# Altium project FS001_Neopixel-Bar-1x32.PrjPcb
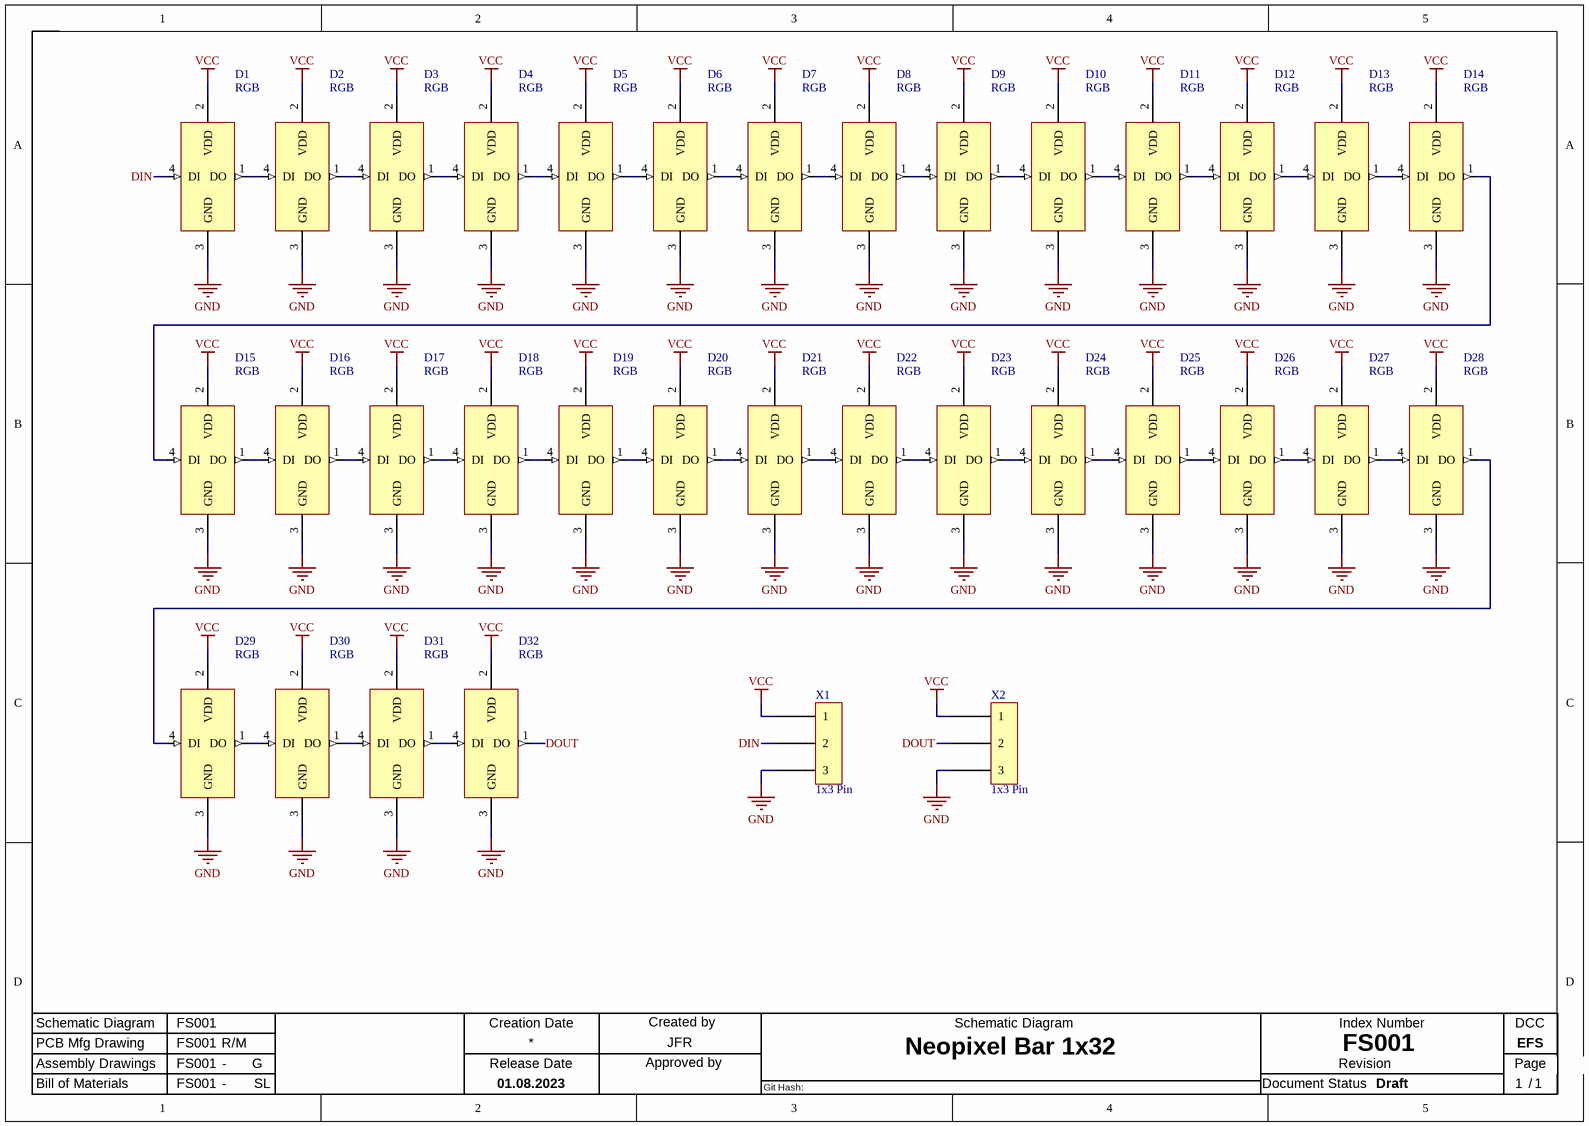
[diagram p0: FS001.SchDoc]
Ausgabedatum: 01.08.2023; Bearbeitende_Person: JFR; Dokumenten_Status: Draft; Leiterplatten_Geraetebezeichnung: Neopixel Bar 1x32; Schaltung_SA_Nummer: FS001
1 sheet, 34 parts. Net scope: global (net labels, ports and power ports of the same name join across sheets).
Board file: FS001.PcbDoc

## Sheet FS001.SchDoc
size 297 x 209 mm; SheetNumber: 1; SheetTotal: 1

### Parts
D1  value RGB  [XINGLIGHT - XL1615RGBC-WS2812B]  (hidden comment: XINGLIGHT - XL-1615RGBC-WS2812B)
D2  value RGB  [XINGLIGHT - XL1615RGBC-WS2812B]  (hidden comment: XINGLIGHT - XL-1615RGBC-WS2812B)
D3  value RGB  [XINGLIGHT - XL1615RGBC-WS2812B]  (hidden comment: XINGLIGHT - XL-1615RGBC-WS2812B)
D4  value RGB  [XINGLIGHT - XL1615RGBC-WS2812B]  (hidden comment: XINGLIGHT - XL-1615RGBC-WS2812B)
D5  value RGB  [XINGLIGHT - XL1615RGBC-WS2812B]  (hidden comment: XINGLIGHT - XL-1615RGBC-WS2812B)
D6  value RGB  [XINGLIGHT - XL1615RGBC-WS2812B]  (hidden comment: XINGLIGHT - XL-1615RGBC-WS2812B)
D7  value RGB  [XINGLIGHT - XL1615RGBC-WS2812B]  (hidden comment: XINGLIGHT - XL-1615RGBC-WS2812B)
D8  value RGB  [XINGLIGHT - XL1615RGBC-WS2812B]  (hidden comment: XINGLIGHT - XL-1615RGBC-WS2812B)
D9  value RGB  [XINGLIGHT - XL1615RGBC-WS2812B]  (hidden comment: XINGLIGHT - XL-1615RGBC-WS2812B)
D10  value RGB  [XINGLIGHT - XL1615RGBC-WS2812B]  (hidden comment: XINGLIGHT - XL-1615RGBC-WS2812B)
D11  value RGB  [XINGLIGHT - XL1615RGBC-WS2812B]  (hidden comment: XINGLIGHT - XL-1615RGBC-WS2812B)
D12  value RGB  [XINGLIGHT - XL1615RGBC-WS2812B]  (hidden comment: XINGLIGHT - XL-1615RGBC-WS2812B)
D13  value RGB  [XINGLIGHT - XL1615RGBC-WS2812B]  (hidden comment: XINGLIGHT - XL-1615RGBC-WS2812B)
D14  value RGB  [XINGLIGHT - XL1615RGBC-WS2812B]  (hidden comment: XINGLIGHT - XL-1615RGBC-WS2812B)
D15  value RGB  [XINGLIGHT - XL1615RGBC-WS2812B]  (hidden comment: XINGLIGHT - XL-1615RGBC-WS2812B)
D16  value RGB  [XINGLIGHT - XL1615RGBC-WS2812B]  (hidden comment: XINGLIGHT - XL-1615RGBC-WS2812B)
D17  value RGB  [XINGLIGHT - XL1615RGBC-WS2812B]  (hidden comment: XINGLIGHT - XL-1615RGBC-WS2812B)
D18  value RGB  [XINGLIGHT - XL1615RGBC-WS2812B]  (hidden comment: XINGLIGHT - XL-1615RGBC-WS2812B)
D19  value RGB  [XINGLIGHT - XL1615RGBC-WS2812B]  (hidden comment: XINGLIGHT - XL-1615RGBC-WS2812B)
D20  value RGB  [XINGLIGHT - XL1615RGBC-WS2812B]  (hidden comment: XINGLIGHT - XL-1615RGBC-WS2812B)
D21  value RGB  [XINGLIGHT - XL1615RGBC-WS2812B]  (hidden comment: XINGLIGHT - XL-1615RGBC-WS2812B)
D22  value RGB  [XINGLIGHT - XL1615RGBC-WS2812B]  (hidden comment: XINGLIGHT - XL-1615RGBC-WS2812B)
D23  value RGB  [XINGLIGHT - XL1615RGBC-WS2812B]  (hidden comment: XINGLIGHT - XL-1615RGBC-WS2812B)
D24  value RGB  [XINGLIGHT - XL1615RGBC-WS2812B]  (hidden comment: XINGLIGHT - XL-1615RGBC-WS2812B)
D25  value RGB  [XINGLIGHT - XL1615RGBC-WS2812B]  (hidden comment: XINGLIGHT - XL-1615RGBC-WS2812B)
D26  value RGB  [XINGLIGHT - XL1615RGBC-WS2812B]  (hidden comment: XINGLIGHT - XL-1615RGBC-WS2812B)
D27  value RGB  [XINGLIGHT - XL1615RGBC-WS2812B]  (hidden comment: XINGLIGHT - XL-1615RGBC-WS2812B)
D28  value RGB  [XINGLIGHT - XL1615RGBC-WS2812B]  (hidden comment: XINGLIGHT - XL-1615RGBC-WS2812B)
D29  value RGB  [XINGLIGHT - XL1615RGBC-WS2812B]  (hidden comment: XINGLIGHT - XL-1615RGBC-WS2812B)
D30  value RGB  [XINGLIGHT - XL1615RGBC-WS2812B]  (hidden comment: XINGLIGHT - XL-1615RGBC-WS2812B)
D31  value RGB  [XINGLIGHT - XL1615RGBC-WS2812B]  (hidden comment: XINGLIGHT - XL-1615RGBC-WS2812B)
D32  value RGB  [XINGLIGHT - XL1615RGBC-WS2812B]  (hidden comment: XINGLIGHT - XL-1615RGBC-WS2812B)
X1  value 1x3 Pin  [Pogo Pads 3-Pin]  (hidden comment: Pogo Pads 3-Pin)  (no BOM)
X2  value 1x3 Pin  [Pogo Pads 3-Pin]  (hidden comment: Pogo Pads 3-Pin)  (no BOM)

### Nets
GND: D1.3(GND) D2.3(GND) D3.3(GND) D4.3(GND) D5.3(GND) D6.3(GND) D7.3(GND) D8.3(GND) D9.3(GND) D10.3(GND) D11.3(GND) D12.3(GND) D13.3(GND) D14.3(GND) D15.3(GND) D16.3(GND) D17.3(GND) D18.3(GND) D19.3(GND) D20.3(GND) D21.3(GND) D22.3(GND) D23.3(GND) D24.3(GND) D25.3(GND) D26.3(GND) D27.3(GND) D28.3(GND) D29.3(GND) D30.3(GND) D31.3(GND) D32.3(GND) X1.3 X2.3
VCC: D1.2(VDD) D2.2(VDD) D3.2(VDD) D4.2(VDD) D5.2(VDD) D6.2(VDD) D7.2(VDD) D8.2(VDD) D9.2(VDD) D10.2(VDD) D11.2(VDD) D12.2(VDD) D13.2(VDD) D14.2(VDD) D15.2(VDD) D16.2(VDD) D17.2(VDD) D18.2(VDD) D19.2(VDD) D20.2(VDD) D21.2(VDD) D22.2(VDD) D23.2(VDD) D24.2(VDD) D25.2(VDD) D26.2(VDD) D27.2(VDD) D28.2(VDD) D29.2(VDD) D30.2(VDD) D31.2(VDD) D32.2(VDD) X1.1 X2.1
DIN: D1.4(DI) X1.2
DOUT: D32.1(DO) X2.2
NetD1_1: D1.1(DO) D2.4(DI)
NetD2_1: D2.1(DO) D3.4(DI)
NetD3_1: D3.1(DO) D4.4(DI)
NetD4_1: D4.1(DO) D5.4(DI)
NetD5_1: D5.1(DO) D6.4(DI)
NetD6_1: D6.1(DO) D7.4(DI)
NetD7_1: D7.1(DO) D8.4(DI)
NetD8_1: D8.1(DO) D9.4(DI)
NetD9_1: D9.1(DO) D10.4(DI)
NetD10_1: D10.1(DO) D11.4(DI)
NetD11_1: D11.1(DO) D12.4(DI)
NetD12_1: D12.1(DO) D13.4(DI)
NetD13_1: D13.1(DO) D14.4(DI)
NetD14_1: D14.1(DO) D15.4(DI)
NetD15_1: D15.1(DO) D16.4(DI)
NetD16_1: D16.1(DO) D17.4(DI)
NetD17_1: D17.1(DO) D18.4(DI)
NetD18_1: D18.1(DO) D19.4(DI)
NetD19_1: D19.1(DO) D20.4(DI)
NetD20_1: D20.1(DO) D21.4(DI)
NetD21_1: D21.1(DO) D22.4(DI)
NetD22_1: D22.1(DO) D23.4(DI)
NetD23_1: D23.1(DO) D24.4(DI)
NetD24_1: D24.1(DO) D25.4(DI)
NetD25_1: D25.1(DO) D26.4(DI)
NetD26_1: D26.1(DO) D27.4(DI)
NetD27_1: D27.1(DO) D28.4(DI)
NetD28_1: D28.1(DO) D29.4(DI)
NetD29_1: D29.1(DO) D30.4(DI)
NetD30_1: D30.1(DO) D31.4(DI)
NetD31_1: D31.1(DO) D32.4(DI)

### Notes on the sheet
- Schematic Diagram
- PCB Mfg Drawing
- Assembly Drawings
- Bill of Materials
- R/M
- -
- G
- SL
- Creation Date
- Release Date
- Approved by
- Created by
- Document Status
- Index Number
- Revision
- DCC
- EFS
- Page
- /
- Git Hash:

### Library data of the parts
D1-D32 = CMP-007-00017-3: Adressable RGB LED in 1615 enclosure; Forward Voltage: 5.5V; Forward Current: 15mA; Wavelength: 0mm; AEC-Q102 Compliant: No; General: LED - Package - Colour; Temperature max.: 150°C; Temperature min.: -40°C; Material-Classification: M3; JLCPCB/LCSC-Nr.: C5349954; ComponentLink1URL: https://datasheet.lcsc.com/lcsc/2301111010_XINGLIGHT-XL-1615RGBC-WS2812B_C5349954.pdf; Package: 0606 (1615x06); Pins: 2; Colour: RGB; Manufacturer: XINGLIGHT; Mounting Style: SMT; Order Number: XL-1615RGBC-WS2812B; ComponentLink1Description: Datasheet; RoHS Compliant: yes
X1 X2 = CMP-022-00007-4: Pads for contacting via spring loaded pogo contacts; Material-Classification: M3; Temperature min.: -40°C; Order Number: NONE; Temperature max.: 120°C; General: Pogo Pads; Package: PCB printed; RoHS Compliant: yes; Mounting Style: PCB printed; Manufacturer: NONE; Pins: 3

## Assembly variants
100: not fitted A100 X100